# Altium schematic sheet MODEM_PT2.SchDoc: VBATT, LED, LVL SHIFT
size 420 x 297 mm; SheetNumber: 4
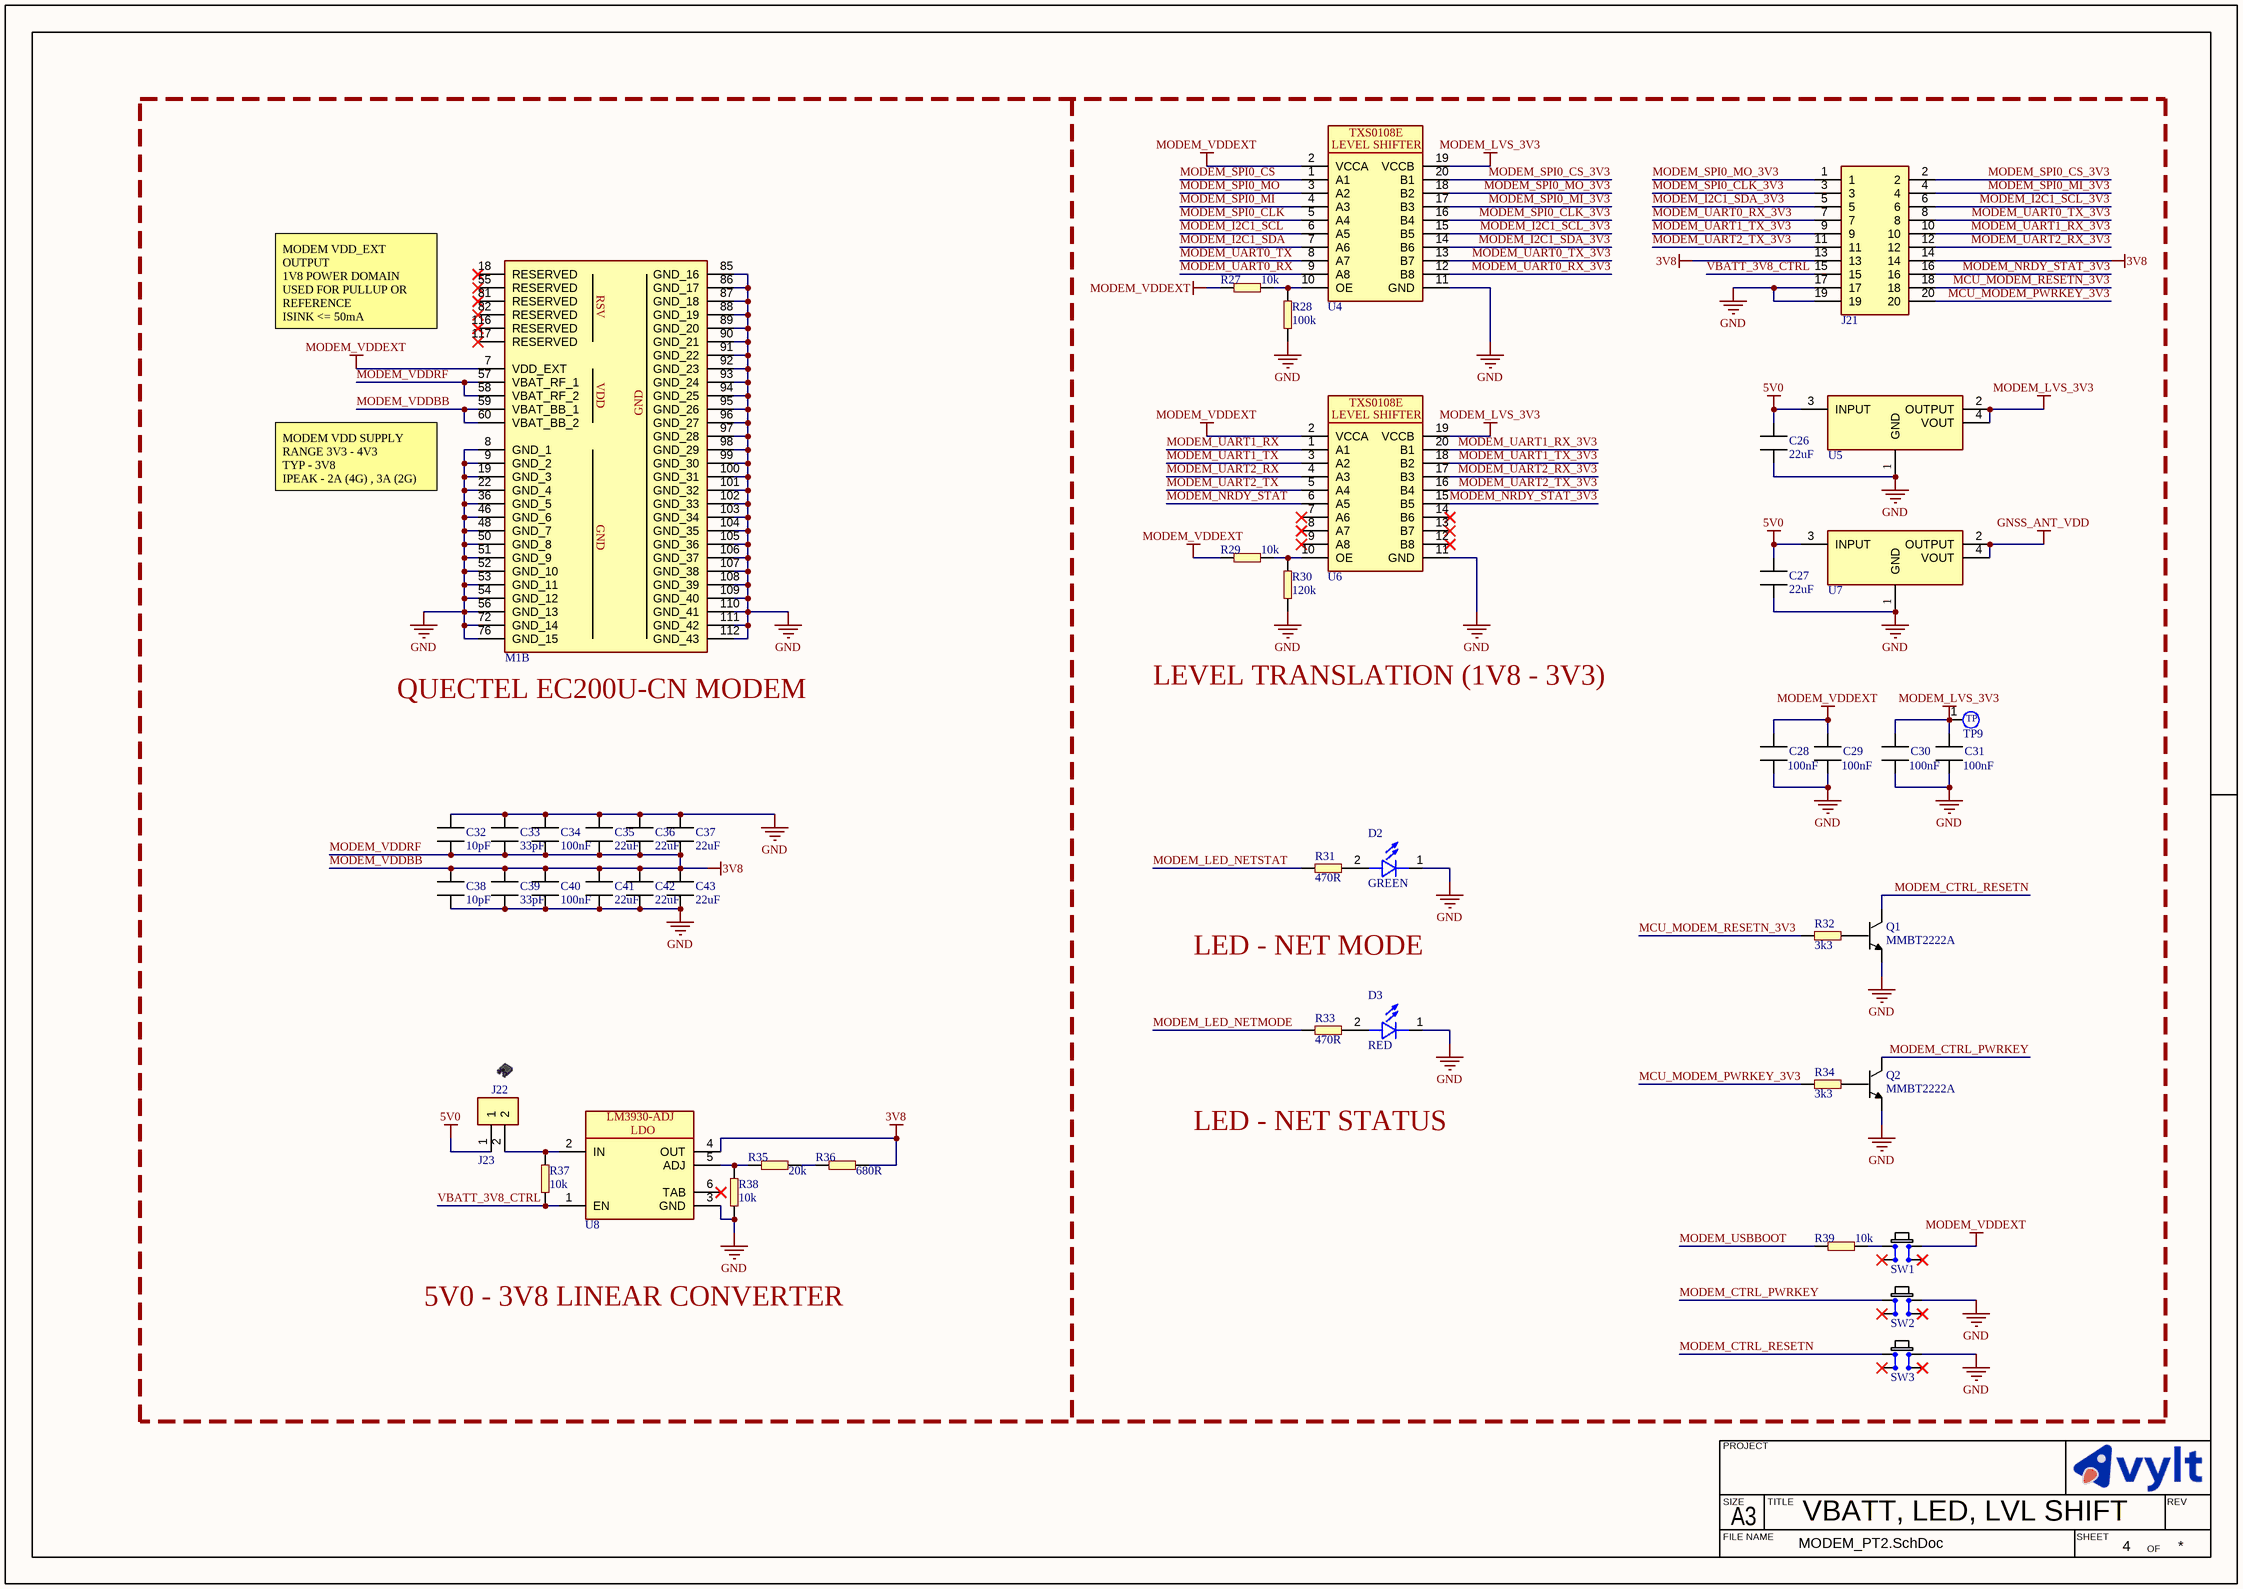
[diagram p0: MODEM_PT2.SchDoc]

## Parts
C26  value 22uF  [CAPC2012X13L]  (hidden comment: MLCC_0805)
C27  value 22uF  [CAPC2012X13L]  (hidden comment: MLCC_0805)
C28  value 100nF  [CAPC2012X13L]  (hidden comment: MLCC_0805)
C29  value 100nF  [CAPC2012X13L]  (hidden comment: MLCC_0805)
C30  value 100nF  [CAPC2012X13L]  (hidden comment: MLCC_0805)
C31  value 100nF  [CAPC2012X13L]  (hidden comment: MLCC_0805)
C32  value 10pF  [CAPC2012X13L]  (hidden comment: MLCC_0805)
C33  value 33pF  [CAPC2012X13L]  (hidden comment: MLCC_0805)
C34  value 100nF  [CAPC2012X13L]  (hidden comment: MLCC_0805)
C35  value 22uF  [CAPC2012X13L]  (hidden comment: MLCC_0805)
C36  value 22uF  [CAPC2012X13L]  (hidden comment: MLCC_0805)
C37  value 22uF  [CAPC2012X13L]  (hidden comment: MLCC_0805)
C38  value 10pF  [CAPC2012X13L]  (hidden comment: MLCC_0805)
C39  value 33pF  [CAPC2012X13L]  (hidden comment: MLCC_0805)
C40  value 100nF  [CAPC2012X13L]  (hidden comment: MLCC_0805)
C41  value 22uF  [CAPC2012X13L]  (hidden comment: MLCC_0805)
C42  value 22uF  [CAPC2012X13L]  (hidden comment: MLCC_0805)
C43  value 22uF  [CAPC2012X13L]  (hidden comment: MLCC_0805)
D2  value GREEN  [LED_1206]  (hidden comment: LED_1206)
D3  value RED  [LED_1206]  (hidden comment: LED_1206)
J21  20PX2R_M  [20PX2R_Male_THT_Shrouded]  (value not drawn)
J22  Jumper Cap  (value not drawn)  (mechanical)
J23  2PX1R  [2PX1R]  (value not drawn)
M1  EC200U  [EC200U]  (value not drawn)  (part B of 2)
Q1  value MMBT2222A  [MMBT2222]  (hidden comment: ERP_105-1)
Q2  value MMBT2222A  [MMBT2222]  (hidden comment: ERP_105-1)
R27  value 10k  [RES_0603]  (hidden comment: ERP_101-1)
R28  value 100k  [RES_0603]  (hidden comment: ERP_101-1)
R29  value 10k  [RES_0603]  (hidden comment: ERP_101-1)
R30  value 120k  [RES_0603]  (hidden comment: ERP_101-1)
R31  value 470R  [RES_0603]  (hidden comment: ERP_101-1)
R32  value 3k3  [RES_0603]  (hidden comment: ERP_101-1)
R33  value 470R  [RES_0603]  (hidden comment: ERP_101-1)
R34  value 3k3  [RES_0603]  (hidden comment: ERP_101-1)
R35  value 20k  [RES_0603]  (hidden comment: ERP_101-1)
R36  value 680R  [RES_0603]  (hidden comment: ERP_101-1)
R37  value 10k  [RES_0603]  (hidden comment: ERP_101-1)
R38  value 10k  [RES_0603]  (hidden comment: ERP_101-1)
R39  value 10k  [RES_0603]  (hidden comment: ERP_101-1)
SW1  Generic6X6  [Generic6X6]  (value not drawn)
SW2  Generic6X6  [Generic6X6]  (value not drawn)
SW3  Generic6X6  [Generic6X6]  (value not drawn)
TP9  TP_1MM  [TP_1MM]  (value not drawn)  (no BOM)
U4  TXS0108EPW  [TXS0108EPW]  (value not drawn)
U5  ERP_123-1  [AMS1117_SOT223]  (value not drawn)
U6  TXS0108EPW  [TXS0108EPW]  (value not drawn)
U7  ERP_123-1  [AMS1117_SOT223]  (value not drawn)
U8  LM39302  [DPAK170P1491X483-6N]  (value not drawn)

## Nets
5V0: C26.1 C27.1 J23.1 U5.3(INPUT) U7.3(INPUT)
GND: C26.2 C27.2 C28.2 C29.2 C30.2 C31.2 C32.1 C33.1 C34.1 C35.1 C36.1 C37.1 C38.2 C39.2 C40.2 C41.2 C42.2 C43.2 D2.1 D3.1 J21.17 J21.19 M1.8(GND_1) M1.9(GND_2) M1.19(GND_3) M1.22(GND_4) M1.36(GND_5) M1.46(GND_6) M1.48(GND_7) M1.50(GND_8) M1.51(GND_9) M1.52(GND_10) M1.53(GND_11) M1.54(GND_12) M1.56(GND_13) M1.72(GND_14) M1.76(GND_15) M1.85(GND_16) M1.86(GND_17) M1.87(GND_18) M1.88(GND_19) M1.89(GND_20) M1.90(GND_21) M1.91(GND_22) M1.92(GND_23) M1.93(GND_24) M1.94(GND_25) M1.95(GND_26) M1.96(GND_27) M1.97(GND_28) M1.98(GND_29) M1.99(GND_30) M1.100(GND_31) M1.101(GND_32) M1.102(GND_33) M1.103(GND_34) M1.104(GND_35) M1.105(GND_36) M1.106(GND_37) M1.107(GND_38) M1.108(GND_39) M1.109(GND_40) M1.110(GND_41) M1.111(GND_42) M1.112(GND_43) Q1.2 Q2.2 R28.2 R30.2 R38.2 SW2.3(COM) SW3.3(COM) U4.11(GND) U5.1(GND) U6.11(GND) U7.1(GND) U8.3(GND)
GNSS_ANT_VDD: U7.2(OUTPUT) U7.4(VOUT)
MODEM_LVS_3V3: C30.1 C31.1 TP9.1 U4.19(VCCB) U5.2(OUTPUT) U5.4(VOUT) U6.19(VCCB)
MODEM_VDDBB: C32.2 C33.2 C34.2 C35.2 C36.2 C37.2 C38.1 C39.1 C40.1 C41.1 C42.1 C43.1 J21.13 J21.14 M1.57(VBAT_RF_1) M1.58(VBAT_RF_2) M1.59(VBAT_BB_1) M1.60(VBAT_BB_2) R36.1 U8.4(OUT)  [also labelled 3V8, MODEM_VDDRF]
MODEM_VDDEXT: C28.1 C29.1 M1.7(VDD_EXT) R27.2 R29.2 SW1.3(COM) U4.2(VCCA) U6.2(VCCA)
MCU_MODEM_PWRKEY_3V3: J21.20 R34.2
MCU_MODEM_RESETN_3V3: J21.18 R32.2
MODEM_CTRL_PWRKEY: Q2.3 SW2.1(NO)
MODEM_CTRL_RESETN: Q1.3 SW3.1(NO)
MODEM_I2C1_SCL: U4.6(A5)
MODEM_I2C1_SCL_3V3: J21.6 U4.15(B5)
MODEM_I2C1_SDA: U4.7(A6)
MODEM_I2C1_SDA_3V3: J21.5 U4.14(B6)
MODEM_LED_NETMODE: R33.2
MODEM_LED_NETSTAT: R31.2
MODEM_NRDY_STAT: U6.6(A5)
MODEM_NRDY_STAT_3V3: J21.16 U6.15(B5)
MODEM_SPI0_CLK: U4.5(A4)
MODEM_SPI0_CLK_3V3: J21.3 U4.16(B4)
MODEM_SPI0_CS: U4.1(A1)
MODEM_SPI0_CS_3V3: J21.2 U4.20(B1)
MODEM_SPI0_MI: U4.4(A3)
MODEM_SPI0_MI_3V3: J21.4 U4.17(B3)
MODEM_SPI0_MO: U4.3(A2)
MODEM_SPI0_MO_3V3: J21.1 U4.18(B2)
MODEM_UART0_RX: U4.9(A8)
MODEM_UART0_RX_3V3: J21.7 U4.12(B8)
MODEM_UART0_TX: U4.8(A7)
MODEM_UART0_TX_3V3: J21.8 U4.13(B7)
MODEM_UART1_RX: U6.1(A1)
MODEM_UART1_RX_3V3: J21.10 U6.20(B1)
MODEM_UART1_TX: U6.3(A2)
MODEM_UART1_TX_3V3: J21.9 U6.18(B2)
MODEM_UART2_RX: U6.4(A3)
MODEM_UART2_RX_3V3: J21.12 U6.17(B3)
MODEM_UART2_TX: U6.5(A4)
MODEM_UART2_TX_3V3: J21.11 U6.16(B4)
MODEM_USBBOOT: R39.2
VBATT_3V8_CTRL: J21.15 R37.2 U8.1(EN)
NetD2_2: D2.2 R31.1
NetD3_2: D3.2 R33.1
NetJ23_2: J23.2 R37.1 U8.2(IN)
NetQ1_1: Q1.1 R32.1
NetQ2_1: Q2.1 R34.1
NetR27_1: R27.1 R28.1 U4.10(OE)
NetR29_1: R29.1 R30.1 U6.10(OE)
NetR35_1: R35.1 R36.2
NetR35_2: R35.2 R38.1 U8.5(ADJ)
NetR39_1: R39.1 SW1.1(NO)

Not connected (* = marked no-connect by the designer): M1 18(RESERVED)* 55(RESERVED)* 81(RESERVED)* 82(RESERVED)* 116(RESERVED)* 117(RESERVED)*; SW1 2(NO)* 4(COM)*; SW2 2(NO)* 4(COM)*; SW3 2(NO)* 4(COM)*; U6 7(A6)* 8(A7)* 9(A8)* 12(B8)* 13(B7)* 14(B6)*; U8 6(TAB)*

## Notes on the sheet
- MODEM VDD_EXT OUTPUT
  1V8 POWER DOMAIN
  USED FOR PULLUP OR REFERENCE
  ISINK <= 50mA
- MODEM VDD SUPPLY
  RANGE 3V3 - 4V3
  TYP - 3V8
  IPEAK - 2A (4G) , 3A (2G)
- (near M1) QUECTEL EC200U-CN MODEM
- LEVEL TRANSLATION (1V8 - 3V3)
- LED - NET MODE
- LED - NET STATUS
- 5V0 - 3V8 LINEAR CONVERTER
- PROJECT
- SIZE
- FILE NAME
- A3
- TITLE
- SHEET
- OF
- REV
- (in symbol EC200U, part B) RSV; VDD; GND
- (in symbol LM39302) LM3930-ADJ; LDO
- (in symbol TP_1MM) TP
- (in symbol TXS0108EPW) TXS0108E; LEVEL SHIFTER

## Library data of the parts
C26-C43 = MLCC_0805: Chip Capacitor, 2-Leads, Body 2.00x1.25mm, IPC High Density; Package: 0805; Manufacturer 1: *; Manufacturer Part Number 1: *
D2 = LED_1206: LED CLEAR 1206 SMD; Manufacturer Part Number 1: 6395; Manufacturer 1: Sunrom
D3 = LED_1206: LED CLEAR 1206 SMD; Manufacturer Part Number 1: 6394; Manufacturer 1: Sunrom
J21 = 20PX2R_M: Connector Header Surface Mount 20 position 0.100" (2.54mm); Manufacturer 1: Cvilux USA; Manufacturer Part Number 1: CH87202V201; Value: *
J22 = Jumper Cap: 2 Pin Jumper Cap P2.54; Manufacturer Part Number 1: *; Manufacturer 1: *; Value: *
M1 = EC200U: LTE CAT1 MODEM 144 SMD; Manufacturer 1: Quectel; Manufacturer Part Number 1: 027-EC200UCNAA-N05-SGNSA; Value: *
Q1 Q2 = MMBT2222: MMBT2222A; ERP: *; Suuplier Part Number 1: *; Supplier 1: *; Manufacturer Part Number 1: *; Manufacturer 1: *; Package: SOT23
R27-R39 = RES_0603: Package: 0603; Manufacturer 1: *; Manufacturer Part Number 1: *
  R31-R38: ERP: *
SW1-SW3 = Generic6X6: Tactile Switch SPST-NO Top Actuated Surface Mount; Manufacturer 1: C&K; Manufacturer Part Number 1: *; Package: 4.5X4.5
U4 U6 = TXS0108EPW: Voltage Level Translator Bidirectional 1 Circuit 8 Channel 60Mbps 20-TSSOP; Manufacturer Part Number 1: TXS0108EPWR; Manufacturer 1: Texas Instruments; Package: 20-TSSOP; Value: *
U5 U7 = AMS1117_SOT223: AMS1117 LDO; Manufacturer 1: TI; Supplier  Part Number 1: *; Supplier  1: *; Package: SOT223; Manufacturer Part Number 1: *
U8 = LM39302: LM39302R HTC TO263 - Adjustable 3A Low-Voltage Low-Dropout Regulator; Manufacturer Part Number 1: *; Manufacturer 1: *; Value: *